# Altium schematic sheet Nucleo.SchDoc: LED Matrix
size A4; Author: Bencsik Dániel Zoltán; Organization: BME-AUT; DocumentNumber: 2; Revision: A7; SheetNumber: 2; SheetTotal: 4
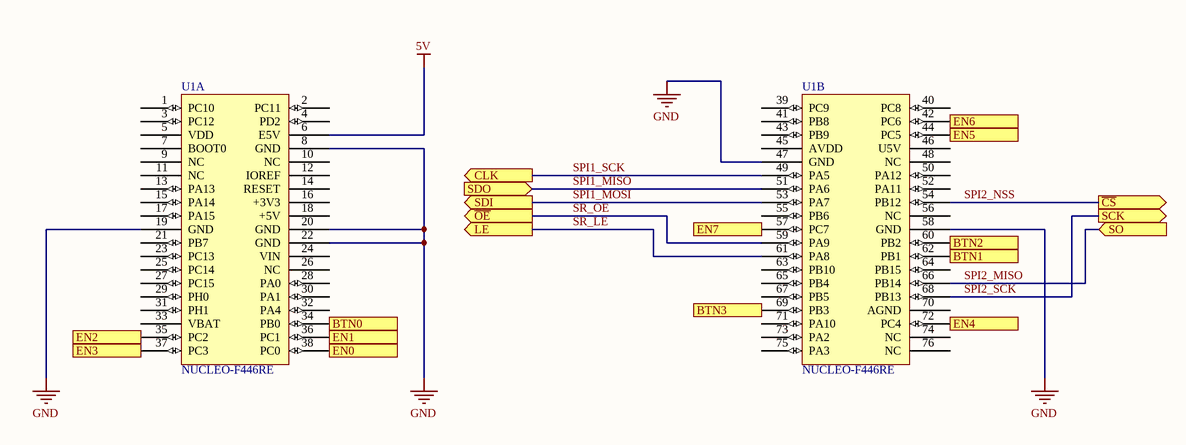
[diagram p0: Nucleo.SchDoc]

## Parts
U1  NUCLEO-F446RE  [FP_NUCLEO-64]  (parts A,B of 2)

## Ports
BTN0 (in), BTN1 (in), BTN2 (in), BTN3 (in), CLK (out), EN0 (out), EN1 (out), EN2 (out), EN3 (out), EN4 (out), EN5 (out), EN6 (out), EN7 (out), LE (out), SCK (out), SDI (out), SDO (in), SO (in), ~{CS} (out), ~{OE} (out)

## Nets
5V: U1.6(E5V)
GND: U1.8(GND) U1.19(GND) U1.20(GND) U1.22(GND) U1.47(GND) U1.58(GND)
BTN0: U1.34(PB0) ; port BTN0
BTN1: U1.62(PB1) ; port BTN1
BTN2: U1.60(PB2) ; port BTN2
BTN3: U1.69(PB3) ; port BTN3
EN0: U1.38(PC0) ; port EN0
EN1: U1.36(PC1) ; port EN1
EN2: U1.35(PC2) ; port EN2
EN3: U1.37(PC3) ; port EN3
EN4: U1.72(PC4) ; port EN4
EN5: U1.44(PC5) ; port EN5
EN6: U1.42(PC6) ; port EN6
EN7: U1.57(PC7) ; port EN7
SPI1_MISO: U1.51(PA6) ; port SDO
SPI1_MOSI: U1.53(PA7) ; port SDI
SPI1_SCK: U1.49(PA5) ; port CLK
SPI2_MISO: U1.66(PB14) ; port SO
SPI2_NSS: U1.54(PB12) ; port ~{CS}
SPI2_SCK: U1.68(PB13) ; port SCK
SR_LE: U1.61(PA8) ; port LE
SR_~{OE}: U1.59(PA9) ; port ~{OE}

Not connected (* = marked no-connect by the designer): U1 1(PC10) 2(PC11) 3(PC12) 4(PD2) 5(VDD) 7(BOOT0) 9(NC) 10(NC) 11(NC) 12(IOREF) 13(PA13) 14(RESET) 15(PA14) 16(+3V3) 17(PA15) 18(+5V) 21(PB7) 23(PC13) 24(VIN) 25(PC14) 26(NC) 27(PC15) 28(PA0) 29(PH0) 30(PA1) 31(PH1) 32(PA4) 33(VBAT) 39(PC9) 40(PC8) 41(PB8) 43(PB9) 45(AVDD) 46(U5V) 48(NC) 50(PA12) 52(PA11) 55(PB6) 56(NC) 63(PB10) 64(PB15) 65(PB4) 67(PB5) 70(AGND) 71(PA10) 73(PA2) 74(NC) 75(PA3) 76(NC)

## Notes on the sheet
- Title
- Size:
- Date:
- A4
- Number:
- Time:
- Revision:
- Sheet
- of
- File:

## Library data of the parts
U1 = NUCLEO-F446RE: Reference: NUCLEO; Name: Nucleo F446RE; Supplier: Tanszék